# Altium schematic sheet Sheet1.SchDoc (part 2 of 2)
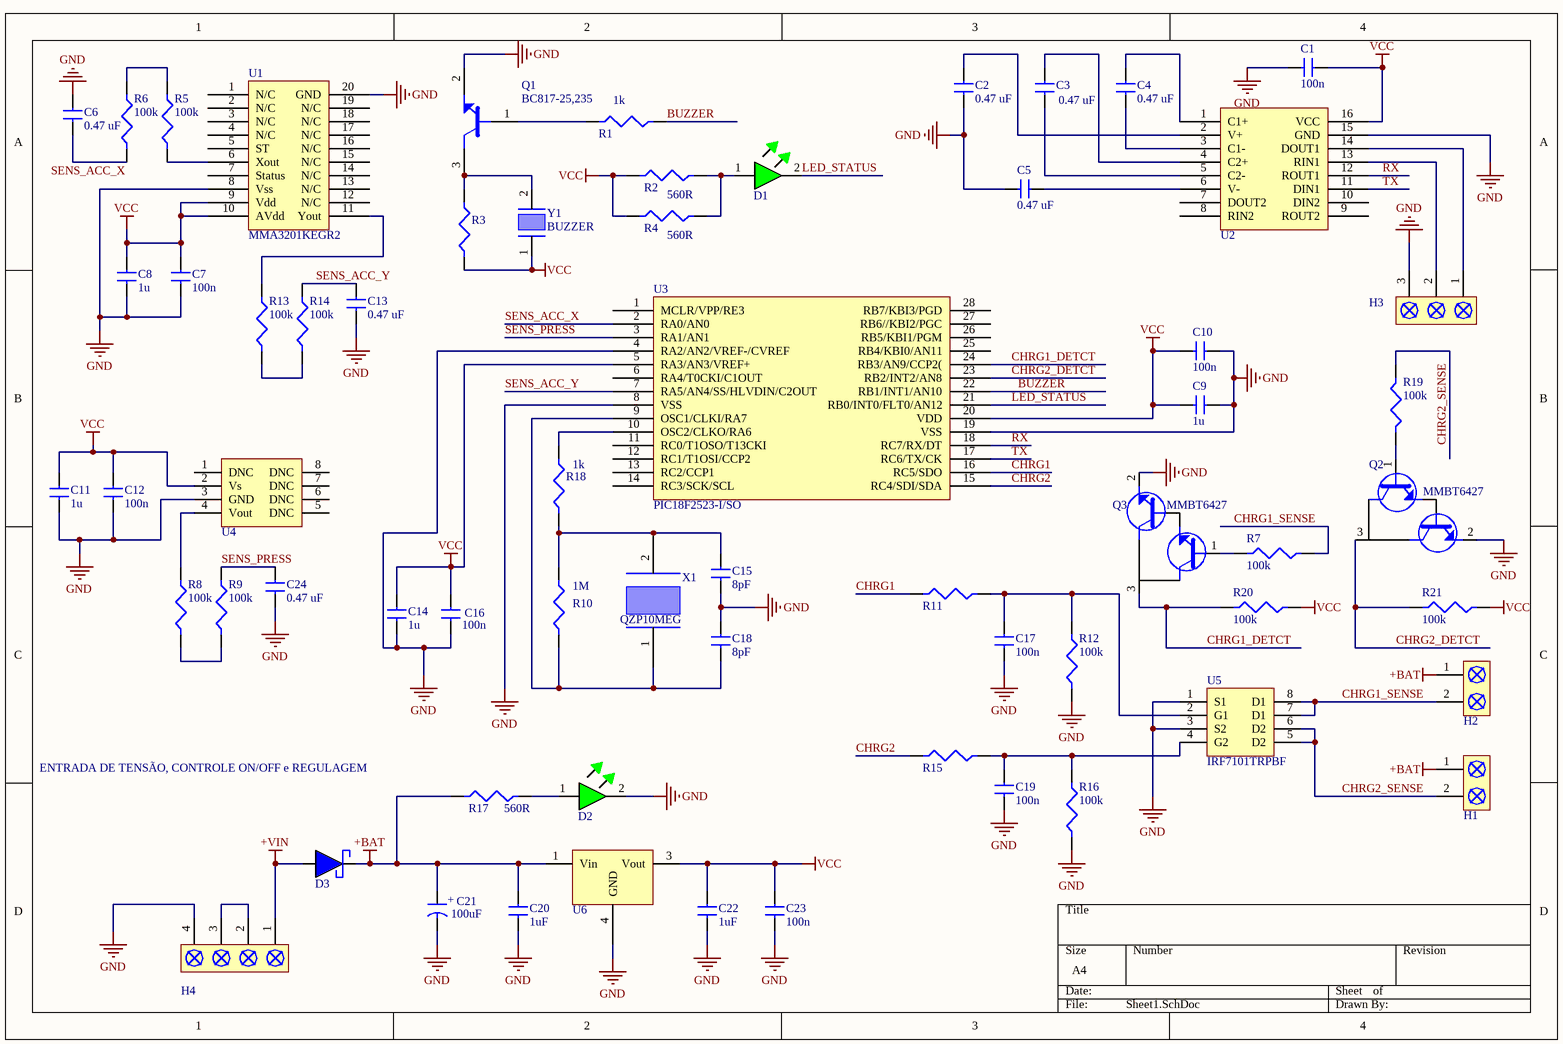
[diagram p1: Sheet1.SchDoc]

## Library data of the parts
C1 C7 C10 C12 C16 C17 C19 C23 = GRM155R71C104KA88D: Multilayer Ceramic Capacitor, 0.1 uF, 16 V, ï¿½ 10%, X7R, 0402 [1005 Metric]; Manufacturer: Murata; Dielectric Material: 4241ConductorMaterial; Capacitance: 100nF; Voltage Rating: 16V; Supplier 1: Future Electronics; Manufacturer Part Number: GRM155R71C104KA88D; RoHS: Yes; Category: Ceramic Capacitors; Stock 1: 33520000; Pricing 1: 10000=0,0044, 40000=0,0043, 100000=0,0042, 250000=0,004, 400000=0,0039 (USD); Mount: Surface Mount; Case/Package: 0402; Number of Pins: 2; Case Code (Metric): 1005; Case Code (Imperial): 0402; Material: Ceramic; Min Operating Temperature: -55°C; Max Operating Temperature: 125°C; Tolerance: 10%; Packaging: Tape and Reel; Voltage Rating (DC): 16V; Package Quantity: 1; Dielectric: X7R; Termination: SMD/SMT; Voltage: 16V; Series: GRM; Length: 1mm; Width: 0.02inch; Height: 0.5mm; Thickness: 0.022inch; Depth: 0.5mm; Radiation Hardening: No; Lead Free: Lead Free; RoHS Compliant: Yes; Reach SVHC Compliant: Unknown; ComponentLink1URL: https://datasheet.ciiva.com/129/grm155r71c104ka88-01-129739.pdf?src-supplier=Digikey; ComponentLink1Description: https://datasheet.ciiva.com/129/grm155r71c104ka88-01-129739.pdf?src-supplier=Digikey; ComponentLink2URL: https://datasheet.ciiva.com/129/grm155r71c104ka88-01-129740.pdf?src-supplier=Digikey; ComponentLink2Description: https://datasheet.ciiva.com/129/grm155r71c104ka88-01-129740.pdf?src-supplier=Digikey; ComponentLink3URL: https://datasheet.ciiva.com/18102/getdatasheetpartid-85307-18102905.pdf?src-supplier=Verical; ComponentLink3Description: https://datasheet.ciiva.com/18102/getdatasheetpartid-85307-18102905.pdf?src-supplier=Verical; ComponentLink4URL: https://datasheet.ciiva.com/29199/454098-da-01-en-vs-kondensator-0402-29199799.pdf?src-supplier=Conrad; ComponentLink4Description: https://datasheet.ciiva.com/29199/454098-da-01-en-vs-kondensator-0402-29199799.pdf?src-supplier=Conrad; ComponentLink5URL: https://datasheet.ciiva.com/7937/4360-7937615.pdf?src-supplier=Element14; ComponentLink5Description: https://datasheet.ciiva.com/7937/4360-7937615.pdf?src-supplier=Element14; ComponentLink6URL: https://datasheet.ciiva.com/28534/4360-28534127.pdf?src-supplier=Element14; ComponentLink6Description: https://datasheet.ciiva.com/28534/4360-28534127.pdf?src-supplier=Element14; ComponentLink7URL: https://datasheet.ciiva.com/28534/4360-28534133.pdf?src-supplier=Element14; ComponentLink7Description: https://datasheet.ciiva.com/28534/4360-28534133.pdf?src-supplier=Element14; ComponentLink8URL: https://datasheet.ciiva.com/16199/product-16199000.pdf?src-supplier=Future+Electronics; ComponentLink8Description: https://datasheet.ciiva.com/16199/product-16199000.pdf?src-supplier=Future+Electronics; ComponentLink9URL: https://datasheet.ciiva.com/14103/grmseries-highdielectrictype-eng-14103750.pdf?src-supplier=Distrelec; ComponentLink9Description: https://datasheet.ciiva.com/14103/grmseries-highdielectrictype-eng-14103750.pdf?src-supplier=Distrelec; ComponentLink10URL: https://datasheet.ciiva.com/14116/grmseries-highdielectrictype-eng-14116878.pdf?src-supplier=Distrelec; ComponentLink10Description: https://datasheet.ciiva.com/14116/grmseries-highdielectrictype-eng-14116878.pdf?src-supplier=Distrelec; Supplier Part Number 1: 5964861
C2-C6 C13 C24 = TMK107F474ZA-T: Multilayer Ceramic Capacitors (High dielectric type), 25V, 0.47 uF, +80%, 0603, Y5V/F, RoHS; Manufacturer: Taiyo; Value: 470nF; Dielectric: Y5V; Supplier: Newark; Supplier Part Number: 08P5185; Manufacturer Part Number: TMK107F474ZA-T; RoHS: No; Case/Package: 0603; Pins: 2; Packaging: Cut Tape; Voltage Rating (DC): 25V; Length: 1.6mm; Width: 800um; Height: 800um; Halogen Free: Halogen Free; Lead Free: Lead Free
C8 C9 C11 C14 = CC1206KKX7R7BB105: Multilayer Ceramic Capacitor, 1 uF, 16 V, ï¿½ 10%, X7R, 1206 [3216 Metric]; Manufacturer: Yageo; Material: 4241ConductorMaterial; Capacitance: 1uF; Voltage Rating: 16V; Insulation Resistance: 100GR; Supplier 1: Future Electronics; Manufacturer Part Number: CC1206KKX7R7BB105; RoHS: Yes; Category: Ceramic Capacitors; Stock 1: 174000; Pricing 1: 3000=0,0252 (USD); Mount: Surface Mount; Case/Package: 1206; Number of Pins: 2; Case Code (Metric): 3216; Case Code (Imperial): 1206; Dielectric Material: Ceramic; Min Operating Temperature: -55°C; Max Operating Temperature: 125°C; Packaging: Tape and Reel; Tolerance: 10%; Voltage Rating (DC): 16V; Package Quantity: 1; Dielectric: X7R; Termination: SMD/SMT; Series: CC; Voltage Rating (AC): 16V; Length: 3.2mm; Width: 0.063inch; Height: 1.15mm; Thickness: 0.045inch; Depth: 1.6mm; Radiation Hardening: No; Reach SVHC Compliant: No; Lead Free: Lead Free; Halogen Free: Halogen Free; RoHS Compliant: Yes; ComponentLink1URL: https://datasheet.ciiva.com/178/mlccorderingcode-178166.pdf?src-supplier=Digikey; ComponentLink1Description: https://datasheet.ciiva.com/178/mlccorderingcode-178166.pdf?src-supplier=Digikey; ComponentLink2URL: https://datasheet.ciiva.com/178/mlccorderingcode-178167.pdf?src-supplier=Digikey; ComponentLink2Description: https://datasheet.ciiva.com/178/mlccorderingcode-178167.pdf?src-supplier=Digikey; ComponentLink3URL: https://datasheet.ciiva.com/178/mlccorderingcode-178168.pdf?src-supplier=Digikey; ComponentLink3Description: https://datasheet.ciiva.com/178/mlccorderingcode-178168.pdf?src-supplier=Digikey; ComponentLink4URL: https://datasheet.ciiva.com/7978/1489800-7978229.pdf?src-supplier=Element14; ComponentLink4Description: https://datasheet.ciiva.com/7978/1489800-7978229.pdf?src-supplier=Element14; ComponentLink5URL: https://datasheet.ciiva.com/11464/upy-gphc-x7r-6-3v-to-50v-8-11464763.pdf?src-supplier=Avnet; ComponentLink5Description: https://datasheet.ciiva.com/11464/upy-gphc-x7r-6-3v-to-50v-8-11464763.pdf?src-supplier=Avnet; Supplier Part Number 1: 9057753
C15 C18 = GRM1555C1H8R0DZ01D: Cap Ceramic 8pF 50V C0G 0.5pF SMD 0402 125°C Paper T/R; Manufacturer: Murata; Supplier: CXDA Electronics; Supplier Part Number: GRM1555C1H8R0DZ01D; Manufacturer Part Number: GRM1555C1H8R0DZ01D; RoHS: Yes; Category: Ceramic Capacitors; Stock: 59869; Pricing: 10=0,05, 100=0,04, 1000=0,04, 10000=0,04 (USD); Mounting Technology: Surface Mount; Case/Package: 0402; Case Code (Metric): 1005; Case Code (Imperial): 0402; Min Operating Temperature: -55°C; Max Operating Temperature: 125°C; Value: 8pF; Voltage Rating: 50V; Packaging: Tape and Reel; Package Quantity: 10000; Dielectric: C0G; Termination: SMD/SMT; Voltage Rating (DC): 50V; Series: GRM; Construction: Flat; Length: 1mm; Width: 0.02inch; Height: 0.5mm; Thickness: 0.022inch; Depth: 0.5mm; Radiation Hardening: No; Lead Free: Lead Free; RoHS Compliant: Yes; ComponentLink1URL: https://datasheet.ciiva.com/3778/8361grm1555c1h8r0dz0123-3778464.pdf?src-supplier=Arrow+Electronics; ComponentLink1Description: https://datasheet.ciiva.com/3778/8361grm1555c1h8r0dz0123-3778464.pdf?src-supplier=Arrow+Electronics; ComponentLink2URL: https://datasheet.ciiva.com/5413/product-5413574.pdf?src-supplier=Mouser; ComponentLink2Description: https://datasheet.ciiva.com/5413/product-5413574.pdf?src-supplier=Mouser; ComponentLink3URL: https://datasheet.ciiva.com/11610/product-11610154.pdf?src-supplier=Avnet; ComponentLink3Description: https://datasheet.ciiva.com/11610/product-11610154.pdf?src-supplier=Avnet
C20 C22 = TPSA105K020R3000: Cap Tant Solid 1uF 20V A CASE 10%( 3.2 X 1.6 X 1.6mm) Inward L SMD 3216-18 3 Ohm 125C T/R; Manufacturer: Kyocera AVX; Dielectric Material: Tantalum; ESR (Equivalent Series Resistance): 3R; Polarity: Polar; Leakage Current: 500nA; Dissipation Factor: 4%; Supplier: Digikey; Supplier Part Number: 478-2399-1-ND; Manufacturer Part Number: TPSA105K020R3000; RoHS: Yes; Category: Tantalum Capacitors; Stock: 46298; Pricing: 1=0,76, 10=0,459, 50=0,3398, 100=0,3028, 500=0,2398, 1000=0,22014, 2000=0,20387, 4000=0,19039, 6000=0,18361, 10000=0,17607, 14000=0,17164, 20000=0,16737, 50000=0,15812 (USD); Mounting Technology: Surface Mount,PCB; Case/Package: 1206; Pins: 2; Case Code (Metric): 3216; Case Code (Imperial): 1206; Weight: 0.000571oz; Min Operating Temperature: -55°C; Max Operating Temperature: 125°C; Value: 1uF; Tolerance: 10%; Voltage Rating: 20V; Packaging: Tape and Reel; Package Quantity: 1; Termination: SMD/SMT; Voltage Rating (DC): 20V; Voltage: 20V; Features: General Purpose; Series: TPS; Construction: Flat; Length: 3.2mm; Width: 1.6mm; Height: 1.6mm; Height - Seated (Max): 0.071inch; Depth: 1.6mm; Lead Pitch: 1.1mm; Radiation Hardening: No; Reach SVHC Compliant: No; Lead Free: Lead Free; RoHS Compliant: Yes; ComponentLink1URL: https://datasheet.ciiva.com/26341/806571-da-01-en-smd-tantal1uf-20v-10-3-000r-2000st-26341825.pdf?src-supplier=Conrad; ComponentLink1Description: https://datasheet.ciiva.com/26341/806571-da-01-en-smd-tantal1uf-20v-10-3-000r-2000st-26341825.pdf?src-supplier=Conrad; ComponentLink2URL: https://datasheet.ciiva.com/263/tps-263911.pdf?src-supplier=Digikey; ComponentLink2Description: https://datasheet.ciiva.com/263/tps-263911.pdf?src-supplier=Digikey; ComponentLink3URL: https://datasheet.ciiva.com/263/tps-263912.pdf?src-supplier=Digikey; ComponentLink3Description: https://datasheet.ciiva.com/263/tps-263912.pdf?src-supplier=Digikey; ComponentLink4URL: https://datasheet.ciiva.com/263/tps-263913.pdf?src-supplier=Digikey; ComponentLink4Description: https://datasheet.ciiva.com/263/tps-263913.pdf?src-supplier=Digikey; ComponentLink5URL: https://datasheet.ciiva.com/7832/1441576-7832617.pdf?src-supplier=Element14; ComponentLink5Description: https://datasheet.ciiva.com/7832/1441576-7832617.pdf?src-supplier=Element14; ComponentLink6URL: https://datasheet.ciiva.com/7832/1441576-7832845.pdf?src-supplier=Element14; ComponentLink6Description: https://datasheet.ciiva.com/7832/1441576-7832845.pdf?src-supplier=Element14; ComponentLink7URL: https://datasheet.ciiva.com/7832/1441576-7832846.pdf?src-supplier=Element14; ComponentLink7Description: https://datasheet.ciiva.com/7832/1441576-7832846.pdf?src-supplier=Element14; ComponentLink8URL: https://datasheet.ciiva.com/7832/tps-7832847.pdf?src-supplier=Element14; ComponentLink8Description: https://datasheet.ciiva.com/7832/tps-7832847.pdf?src-supplier=Element14; ComponentLink9URL: https://datasheet.ciiva.com/28555/1932865-28555241.pdf?src-supplier=Element14; ComponentLink9Description: https://datasheet.ciiva.com/28555/1932865-28555241.pdf?src-supplier=Element14; ComponentLink10URL: https://datasheet.ciiva.com/12910/tps-23028-12910247.pdf?src-supplier=Mouser; ComponentLink10Description: https://datasheet.ciiva.com/12910/tps-23028-12910247.pdf?src-supplier=Mouser; ComponentLink11URL: https://datasheet.ciiva.com/16224/tps-16224686.pdf?src-supplier=Future+Electronics; ComponentLink11Description: https://datasheet.ciiva.com/16224/tps-16224686.pdf?src-supplier=Future+Electronics; ComponentLink12URL: https://datasheet.ciiva.com/14590/70001047-14590583.pdf?src-supplier=Allied+Electronics; ComponentLink12Description: https://datasheet.ciiva.com/14590/70001047-14590583.pdf?src-supplier=Allied+Electronics; ComponentLink13URL: https://datasheet.ciiva.com/14590/70001047-14590587.pdf?src-supplier=Allied+Electronics; ComponentLink13Description: https://datasheet.ciiva.com/14590/70001047-14590587.pdf?src-supplier=Allied+Electronics; ComponentLink14URL: https://datasheet.ciiva.com/3004/tps-3004579.pdf?src-supplier=Avnet; ComponentLink14Description: https://datasheet.ciiva.com/3004/tps-3004579.pdf?src-supplier=Avnet
C21 = B45197A3107K509: Cap 100UF 16VDC 10% 7.3 X 4.3 X 4.1MM SMD 7343-43 T/r; Manufacturer: KEMET; Dielectric Material: Tantalum; Voltage Rating: 16V; ESR (Equivalent Series Resistance): 100mR; Leakage Current: 16uA; Dissipation Factor: 8%; Supplier 1: Farnell; Manufacturer Part Number: B45197A3107K509; RoHS: Yes; Category: Tantalum Capacitors; Pricing 1: 1=2,31, 10=1,54, 50=1,07, 100=0,889, 200=0,771, 400=0,66, 2000=0,578 (GBP); Mount: Surface Mount; Case/Package: 2917; Number of Pins: 2; Case Code (Imperial): 2917; Case Code (Metric): 7343; Weight: 0.023634oz; Min Operating Temperature: -55°C; Max Operating Temperature: 125°C; Capacitance: 100uF; Tolerance: 10%; Voltage Rating (DC): 16V; Packaging: Tape and Reel; Termination: SMD/SMT; Series: B45197A; Voltage: 16V; Length: 7.3mm; Width: 4.3mm; Height: 4.4mm; Depth: 4.3mm; RoHS Compliant: Yes; Reach SVHC Compliant: No; Lead Free: Lead Free; ComponentLink1URL: https://datasheet.ciiva.com/5934/58264-5934481.pdf?src-supplier=Farnell; ComponentLink1Description: https://datasheet.ciiva.com/5934/58264-5934481.pdf?src-supplier=Farnell; ComponentLink2URL: https://datasheet.ciiva.com/11793/0900766b809b4274-11793801.pdf?src-supplier=Rs; ComponentLink2Description: https://datasheet.ciiva.com/11793/0900766b809b4274-11793801.pdf?src-supplier=Rs; ComponentLink3URL: https://datasheet.ciiva.com/1464/1761160-1464734.pdf?src-supplier=Element14; ComponentLink3Description: https://datasheet.ciiva.com/1464/1761160-1464734.pdf?src-supplier=Element14; ComponentLink4URL: https://datasheet.ciiva.com/1464/1761160-1464735.pdf?src-supplier=Element14; ComponentLink4Description: https://datasheet.ciiva.com/1464/1761160-1464735.pdf?src-supplier=Element14; Supplier Part Number 1: 9751084
D1 D2 = LNJ314G8TRA: Led SMT Grn Cut Tapes; Manufacturer: Panasonic SSG; Color: Green; Forward Current: 10mA; Forward Voltage: 2.03V; Luminous Intensity: 5mcd; Power Rating: 40mW; Lens Style: Flat,Rectangular; Wavelength: 565nm; Number of LEDs: 1; Lens Size: 0.8mm; Supplier 1: Ampacity Systems; Manufacturer Part Number: LNJ314G8TRA; RoHS: Yes; Category: LEDs; Stock 1: 450; Pricing 1: 1=1,03385 (USD); Mount: Surface Mount; Case/Package: 0603; Number of Pins: 2; Case Code (Metric): 1608; Case Code (Imperial): 0603; Min Operating Temperature: -30°C; Max Operating Temperature: 85°C; Packaging: Tape and Reel; Illumination Color: Green; Test Current: 10mA; Series: -; Length: 1.6mm; Width: 0.8mm; Height: 0.5mm; Radiation Hardening: No; Lead Free: Lead Free; RoHS Compliant: Yes; ComponentLink1URL: https://datasheet.ciiva.com/9326/lnj314g8tra-bek-discon-9326750.pdf?src-supplier=Avnet; ComponentLink1Description: https://datasheet.ciiva.com/9326/lnj314g8tra-bek-discon-9326750.pdf?src-supplier=Avnet; Supplier Part Number 1: LNJ314G8TRA
D3 = SD0805S020S1R0: Small Signal Schottky Diode, Single, 20 V, 1 A, 450 Mv, 10 A, 125 C Rohs Compliant: Yes; Manufacturer: Kyocera AVX; Max Surge Current: 10A; Forward Voltage: 450mV; Forward Current: 1A; Max Reverse Current: 200uA; Max Repetitive Reverse Voltage (Vrrm): 20V; Supplier: Digikey; Supplier Part Number: 478-7800-1-ND; Manufacturer Part Number: SD0805S020S1R0; RoHS: Yes; Category: Rectifier Diodes; Stock: 72775; Pricing: 1=0,51, 10=0,311, 100=0,1972, 500=0,14792, 1000=0,132, 3000=0,11174, 6000=0,10152, 9000=0,09631, 15000=0,09046, 21000=0,08699, 30000=0,08362, 75000=0,07622 (USD); Mounting Technology: Surface Mount; Case/Package: 0805; Pins: 2; Case Code (Metric): 2012; Case Code (Imperial): 0805; Min Operating Temperature: -55°C; Max Operating Temperature: 125°C; Packaging: Cut Tape; Average Rectified Current: 1A; Max Reverse Leakage Current: 200uA; Max Forward Surge Current (Ifsm): 10A; Peak Non-Repetitive Surge Current: 10A; Max Reverse Voltage (DC): 20V; Series: -; Radiation Hardening: No; Reach SVHC Compliant: No; RoHS Compliant: Yes; ComponentLink1URL: https://datasheet.ciiva.com/29883/schottky-29883740.pdf?src-supplier=Avnet; ComponentLink1Description: https://datasheet.ciiva.com/29883/schottky-29883740.pdf?src-supplier=Avnet; ComponentLink2URL: https://datasheet.ciiva.com/29883/schottky-29883741.pdf?src-supplier=Avnet; ComponentLink2Description: https://datasheet.ciiva.com/29883/schottky-29883741.pdf?src-supplier=Avnet; ComponentLink3URL: https://datasheet.ciiva.com/13084/schottky-221155-13084174.pdf?src-supplier=Mouser; ComponentLink3Description: https://datasheet.ciiva.com/13084/schottky-221155-13084174.pdf?src-supplier=Mouser
H1 H2 = 1725656: Block, Terminal; 6 A; 63 V; 2.54 mm; 26 to 20 AWG; 2; Screw; Soldering; 1.5 kV; Manufacturer: Phoenix Contact; Number of Poles: 2; Voltage Rating: 125V; Max Current Rating: 6A; Max Supply Voltage: 63V; Number of Levels: 1; Connector Type: Screw,PCB,Terminal Block; Wire Gauge (Max): 26AWG; Wire Gauge (Min): 20AWG; Pitch: 2.54mm; Stripping Length: 4.5mm; Approvals: UL,CSA,cULus,EAC; Supplier 1: Mouser; Manufacturer Part Number: 1725656; RoHS: Yes; Category: Terminal Blocks; Stock 1: 18801; Pricing 1: 1=1,66, 10=1,14, 50=1,14, 100=1,14, 1000=1,13, 10000=1,13 (USD); Mount: Through Hole; Number of Pins: 2; Color: Green; Weight: 0.022575oz; Housing Material: Polyamide; Contact Material: Tin; Housing Color: 49Colour; Insulation Material: 4261ConductorMaterial; Termination: Solder; Orientation: Straight; Package Quantity: 50; Packaging: Bulk; Number of Rows: 1; Current Rating: 6A; Number of Positions Per Level: 2; Current: 6A; Voltage: 125V; Number of Positions: 2; Number of Contacts: 2; Number of Circuits: 2; Series: MPT; Length: 5.54mm; Width: 12mm; Height: 6.2mm; Wire/Cable Gauge: 26AWG; Depth: 6.2mm; Radiation Hardening: No; RoHS Compliant: Yes; Reach SVHC Compliant: No; Lead Free: Lead Free; Flammability Rating: UL94 V-0; ComponentLink1URL: https://datasheet.ciiva.com/823/1725656-823793.pdf?src-supplier=Digikey; ComponentLink1Description: https://datasheet.ciiva.com/823/1725656-823793.pdf?src-supplier=Digikey; ComponentLink2URL: https://datasheet.ciiva.com/1120/319957-1120510.pdf?src-supplier=Farnell; ComponentLink2Description: https://datasheet.ciiva.com/1120/319957-1120510.pdf?src-supplier=Farnell; ComponentLink3URL: https://datasheet.ciiva.com/15169/getdatasheetpartid-199323-15169849.pdf?src-supplier=Verical; ComponentLink3Description: https://datasheet.ciiva.com/15169/getdatasheetpartid-199323-15169849.pdf?src-supplier=Verical; ComponentLink4URL: https://datasheet.ciiva.com/16071/1725656-16071846.pdf?src-supplier=Onlinecomponents.com; ComponentLink4Description: https://datasheet.ciiva.com/16071/1725656-16071846.pdf?src-supplier=Onlinecomponents.com; ComponentLink5URL: https://datasheet.ciiva.com/26340/788052-da-01-en-100ntklemme-1725656-250-st-26340907.pdf?src-supplier=Conrad; ComponentLink5Description: https://datasheet.ciiva.com/26340/788052-da-01-en-100ntklemme-1725656-250-st-26340907.pdf?src-supplier=Conrad; Supplier Part Number 1: 651-1725656
H3 = 1725669: Terminal Block Connector; 6 A; 63 V; 2.54 mm; 26 to 20 AWG; 3; Screw; Soldering; 1.5 kV; Manufacturer: Phoenix Contact; Current Rating: 6A; Number of Poles: 3; Voltage Rating: 125V; Max Supply Voltage: 63V; Number of Levels: 1; Connector Type: Screw,PCB,Terminal Block; Wire/Cable Gauge: 26AWG; Wire Gauge (Min): 20AWG; Pitch: 2.54mm; Stripping Length: 4.5mm; Approvals: UL,CSA,cULus,EAC; Supplier 1: Onlinecomponents.com; Manufacturer Part Number: 1725669; RoHS: Yes; Category: Terminal Blocks; Stock 1: 743; Pricing 1: 10=2,04, 100=1,77, 250=1,72, 500=1,68, 1000=1,64, 2500=1,61, 5000=1,59, 7500=1,57 (USD); Mount: Through Hole; Number of Pins: 3; Weight: 0.021658oz; Color: Green; Housing Color: Green; Housing Material: Polyamide; Insulation Material: Nylon; Contact Material: Tin; Package Quantity: 250; Number of Rows: 1; Max Current Rating: 6A; Packaging: Bulk; Number of Positions: 3; Termination: Solder; Number of Positions Per Level: 3; Current: 6A; Voltage: 125V; Number of Contacts: 3; Number of Circuits: 3; Orientation: Straight; Series: MPT; Length: 6.2mm; Width: 13mm; Height: 8.08mm; Wire Gauge (Max): 26AWG; Depth: 6.2mm; Radiation Hardening: No; Reach SVHC Compliant: No; Lead Free: Lead Free; Flammability Rating: UL94 V-0; RoHS Compliant: Yes; ComponentLink1URL: https://datasheet.ciiva.com/823/1725669-823803.pdf?src-supplier=Digikey; ComponentLink1Description: https://datasheet.ciiva.com/823/1725669-823803.pdf?src-supplier=Digikey; ComponentLink2URL: https://datasheet.ciiva.com/1118/1761576-1118544.pdf?src-supplier=Element14; ComponentLink2Description: https://datasheet.ciiva.com/1118/1761576-1118544.pdf?src-supplier=Element14; ComponentLink3URL: https://datasheet.ciiva.com/7053/312657-7053092.pdf?src-supplier=Newark; ComponentLink3Description: https://datasheet.ciiva.com/7053/312657-7053092.pdf?src-supplier=Newark; ComponentLink4URL: https://datasheet.ciiva.com/3969/1725669-3969975.pdf?src-supplier=Arrow+Electronics; ComponentLink4Description: https://datasheet.ciiva.com/3969/1725669-3969975.pdf?src-supplier=Arrow+Electronics; ComponentLink5URL: https://datasheet.ciiva.com/15169/getdatasheetpartid-178016-15169707.pdf?src-supplier=Verical; ComponentLink5Description: https://datasheet.ciiva.com/15169/getdatasheetpartid-178016-15169707.pdf?src-supplier=Verical; ComponentLink6URL: https://datasheet.ciiva.com/16071/1725669-16071848.pdf?src-supplier=Onlinecomponents.com; ComponentLink6Description: https://datasheet.ciiva.com/16071/1725669-16071848.pdf?src-supplier=Onlinecomponents.com; ComponentLink7URL: https://datasheet.ciiva.com/14607/70054336-14607349.pdf?src-supplier=Allied+Electronics; ComponentLink7Description: https://datasheet.ciiva.com/14607/70054336-14607349.pdf?src-supplier=Allied+Electronics; ComponentLink8URL: https://datasheet.ciiva.com/29223/717267-da-01-en-printklemme-1725669-250-st-29223852.pdf?src-supplier=Conrad; ComponentLink8Description: https://datasheet.ciiva.com/29223/717267-da-01-en-printklemme-1725669-250-st-29223852.pdf?src-supplier=Conrad; Supplier Part Number 1: 1725669
H4 = MPT0,5/4-2,54: Wire-To-Board Terminal Block Rating to EN: 6 A @ 63 VAC/VDC Rating to UL: 6 A @ 125 VAC/VDC Temperature range: -20...; Manufacturer: Phoenix Contact; Max Current Rating: 6A; Max Supply Voltage: 63V; Wire Gauge (Max): 26AWG; Wire Gauge (Min): 20AWG; Supplier 1: Sourcengine; Manufacturer Part Number: MPT0,5/4-2,54; RoHS: Yes; Category: Terminal Blocks; Stock 1: 49; Number of Pins: 4; Housing Material: 4261ConductorMaterial; Termination: Screw; Number of Rows: 1NUMBER; Orientation: 5491OrientationType; Length: 10.62mm; Depth: 6.2mm; RoHS Compliant: Yes; ComponentLink1URL: https://www.distrelec.biz/Web/Downloads/20/76/uu142076.pdf?mime=application%2Fpdf&src-supplier=Distrelec; ComponentLink1Description: https://www.distrelec.biz/Web/Downloads/20/76/uu142076.pdf?mime=application%2Fpdf&src-supplier=Distrelec; Supplier Part Number 1: MPT0,5/4-2,54
Q1 = BC817-25,235: BC817 Series 45V 500mA SMT NPN General Purpose Transistor - SOT-23; Manufacturer: Nexperia; Collector Base Voltage (VCBO): 50V; Collector Emitter Saturation Voltage: 700mV; Emitter Base Voltage (VEBO): 5V; hFE Min: 160; Number of Elements: 1; Power Dissipation: 250mW; Supplier 1: Future Electronics; Manufacturer Part Number: BC817-25,235; RoHS: Yes; Category: BJTs; Stock 1: 6440000; Pricing 1: 10000=0,0123, 30000=0,0119, 50000=0,0117, 100000=0,0114, 200000=0,011 (USD); Number of Pins: 3; Max Operating Temperature: 150°C; Packaging: Tape and Reel; Polarity: NPN; Collector Emitter Breakdown Voltage: 45V; Collector Emitter Voltage (VCEO): 45V; Max Collector Current: 500mA; Height: 1.1mm; RoHS Compliant: Yes; ComponentLink1URL: https://datasheet.octopart.com/BC817-25%2C235-Nexperia-datasheet-108335331.pdf?src-supplier=Farnell; ComponentLink1Description: https://datasheet.octopart.com/BC817-25%2C235-Nexperia-datasheet-108335331.pdf?src-supplier=Farnell; ComponentLink2URL: https://assets.nexperia.com/documents/data-sheet/BC817_SER.pdf?src-supplier=Digikey; ComponentLink2Description: https://assets.nexperia.com/documents/data-sheet/BC817_SER.pdf?src-supplier=Digikey; Supplier Part Number 1: 3451903
Q2 Q3 = MMBT6427-7-F: MMBT6427 Series 40 V 500 mA NPN Surface Mount Darlington Transistor - SOT-23-3; Manufacturer: Diodes; Collector Emitter Voltage (VCEO): 40V; hFE Min: 10000; Max Collector Current: 500mA; Max Power Dissipation: 300mW; Emitter Base Voltage (VEBO): 12V; Collector Emitter Saturation Voltage: 1.2V; Number of Elements: 1; Collector-emitter Voltage-Max: 1.5V; Supplier 1: Digikey; Manufacturer Part Number: MMBT6427-7-F; RoHS: Yes; Category: BJTs; Stock 1: 25429; Pricing 1: 1=0,21, 10=0,128, 100=0,0796, 500=0,05812, 1000=0,05115 (USD); Mount: Surface Mount; Case/Package: SOT-23; Number of Pins: 3; Weight: 0.000282oz; Min Operating Temperature: -55°C; Max Operating Temperature: 150°C; Packaging: Tape and Reel; Package Quantity: 3000; Polarity: NPN; Collector Base Voltage (VCBO): 40V; Collector Emitter Breakdown Voltage: 40V; Max Breakdown Voltage: 40V; Current Rating: 500mA; Voltage Rating (DC): 40V; Series: Automotive, AEC-Q101; Length: 3.05mm; Width: 1.4mm; Height: 1mm; Radiation Hardening: No; Lead Free: Lead Free; RoHS Compliant: Yes; ComponentLink1URL: https://datasheet.ciiva.com/11211/ds30048-11211443.pdf?src-supplier=Avnet; ComponentLink1Description: https://datasheet.ciiva.com/11211/ds30048-11211443.pdf?src-supplier=Avnet; ComponentLink2URL: https://datasheet.ciiva.com/4459/ds30048-82966-4459317.pdf?src-supplier=Mouser; ComponentLink2Description: https://datasheet.ciiva.com/4459/ds30048-82966-4459317.pdf?src-supplier=Mouser; ComponentLink3URL: https://datasheet.ciiva.com/15139/getdatasheetpartid-67553-15139920.pdf?src-supplier=Verical; ComponentLink3Description: https://datasheet.ciiva.com/15139/getdatasheetpartid-67553-15139920.pdf?src-supplier=Verical; ComponentLink4URL: https://datasheet.ciiva.com/973/ds30048-973062.pdf?src-supplier=Digikey; ComponentLink4Description: https://datasheet.ciiva.com/973/ds30048-973062.pdf?src-supplier=Digikey; ComponentLink5URL: https://datasheet.ciiva.com/973/ds30048-973063.pdf?src-supplier=Digikey; ComponentLink5Description: https://datasheet.ciiva.com/973/ds30048-973063.pdf?src-supplier=Digikey; Supplier Part Number 1: MMBT6427-FDICT-ND
R1 R3 R11 R15 R18 = CRCW04021K00JNED: Res Thick Film 0402 1K Ohm 5% 1/16W ±200ppm/°C Molded SMD SMD Paper T/R; Manufacturer: Vishay Dale; Resistance: 1kR; Max Power Dissipation: 63mW; Voltage Rating: 50V; Supplier 1: Mouser; Manufacturer Part Number: CRCW04021K00JNED; RoHS: Yes; Category: Chip SMD Resistors; Stock 1: 255010; Pricing 1: 1=0,1, 10=0,016, 50=0,016, 100=0,009, 1000=0,008, 2500=0,006, 10000=0,004, 20000=0,003 (USD); Case/Package: 0402; Number of Pins: 2; Case Code (Imperial): 0402; Case Code (Metric): 1005; Weight: 2.3E-05oz; Contact Plating: Tin; Min Operating Temperature: -55°C; Max Operating Temperature: 155°C; Packaging: Tape and Reel; Tolerance: 5%; Number of Terminations: 2; Temperature Coefficient: 200ppm/°C; Series: CRCW; Power Rating: 63mW; Package Quantity: 1; Termination: SMD/SMT; Features: Automotive AEC-Q200; Technology: THICK FILM; Resistor Type: Thick Film; Working Voltage: 50V; Resistance Tolerance: 5%; Construction: Rectangular; Voltage Rating (DC): 50V; Length: 1mm; Width: 0.02inch; Height: 0.016inch; Depth: 0.5mm; Ratings: AEC-Q200; Radiation Hardening: No; RoHS Compliant: Yes; Lead Free: Lead Free; Military Standard: Not; Reach SVHC Compliant: Unknown; ComponentLink1URL: https://datasheet.ciiva.com/2462/dcrcwe3-2462076.pdf?src-supplier=Digikey; ComponentLink1Description: https://datasheet.ciiva.com/2462/dcrcwe3-2462076.pdf?src-supplier=Digikey; ComponentLink2URL: https://datasheet.ciiva.com/2462/dcrcwe3-2462077.pdf?src-supplier=Digikey; ComponentLink2Description: https://datasheet.ciiva.com/2462/dcrcwe3-2462077.pdf?src-supplier=Digikey; ComponentLink3URL: https://datasheet.ciiva.com/2462/dcrcwe3-2462078.pdf?src-supplier=Digikey; ComponentLink3Description: https://datasheet.ciiva.com/2462/dcrcwe3-2462078.pdf?src-supplier=Digikey; ComponentLink4URL: https://datasheet.ciiva.com/7743/dcrcwe3-7743478.pdf?src-supplier=Element14; ComponentLink4Description: https://datasheet.ciiva.com/7743/dcrcwe3-7743478.pdf?src-supplier=Element14; ComponentLink5URL: https://datasheet.ciiva.com/5545/dcrcwe3-109170-5545913.pdf?src-supplier=Mouser; ComponentLink5Description: https://datasheet.ciiva.com/5545/dcrcwe3-109170-5545913.pdf?src-supplier=Mouser; ComponentLink6URL: https://datasheet.ciiva.com/28621/1847332-28621342.pdf?src-supplier=Element14; ComponentLink6Description: https://datasheet.ciiva.com/28621/1847332-28621342.pdf?src-supplier=Element14; ComponentLink7URL: https://datasheet.ciiva.com/16199/dcrcwe3-16199256.pdf?src-supplier=Future+Electronics; ComponentLink7Description: https://datasheet.ciiva.com/16199/dcrcwe3-16199256.pdf?src-supplier=Future+Electronics; ComponentLink8URL: https://datasheet.ciiva.com/16778/70201119-16778053.pdf?src-supplier=Allied+Electronics; ComponentLink8Description: https://datasheet.ciiva.com/16778/70201119-16778053.pdf?src-supplier=Allied+Electronics; Supplier Part Number 1: 71-CRCW0402J-1.0K-E3
R2 R4 R17 = CRCW0402560RJNED: SMD Chip Resistor, 560 Ohm, ± 5%, 63 mW, 0402 [1005 Metric], Thick Film, General Purpose; Manufacturer: Vishay Dale; Power Rating: 63mW; Temperature Coefficient: 200ppm/°C; Voltage Rating: 50V; Supplier 1: Mouser; Manufacturer Part Number: CRCW0402560RJNED; RoHS: Yes; Category: Chip SMD Resistors; Stock 1: 36463; Pricing 1: 1=0,1, 10=0,015, 50=0,015, 100=0,009, 1000=0,007, 2500=0,006, 10000=0,004 (USD); Case/Package: 0402; Number of Pins: 2; Case Code (Metric): 1005; Case Code (Imperial): 0402; Contact Plating: Tin; Weight: 2.3E-05oz; Size Code: 0402; Min Operating Temperature: -55°C; Max Operating Temperature: 155°C; Resistance: 560R; Packaging: Cut Tape; Tolerance: 5%; Package Quantity: 10000; Resistor Type: Thick Film; Number of Terminations: 2; Max Power Dissipation: 63mW; Features: Automotive AEC-Q200; Series: CRCW; Voltage Rating (DC): 50V; Resistance Tolerance: 5%; Length: 1mm; Width: 0.5mm; Height: 0.35mm; Ratings: AEC-Q200; Radiation Hardening: No; Lead Free: Lead Free; RoHS Compliant: Yes; Reach SVHC Compliant: Unknown; ComponentLink1URL: https://datasheet.ciiva.com/2524/dcrcwe3-2524414.pdf?src-supplier=Digikey; ComponentLink1Description: https://datasheet.ciiva.com/2524/dcrcwe3-2524414.pdf?src-supplier=Digikey; ComponentLink2URL: https://datasheet.ciiva.com/2524/dcrcwe3-2524415.pdf?src-supplier=Digikey; ComponentLink2Description: https://datasheet.ciiva.com/2524/dcrcwe3-2524415.pdf?src-supplier=Digikey; ComponentLink3URL: https://datasheet.ciiva.com/2524/dcrcwe3-2524416.pdf?src-supplier=Digikey; ComponentLink3Description: https://datasheet.ciiva.com/2524/dcrcwe3-2524416.pdf?src-supplier=Digikey; ComponentLink4URL: https://datasheet.ciiva.com/3256/dcrcwe3-3256649.pdf?src-supplier=Avnet; ComponentLink4Description: https://datasheet.ciiva.com/3256/dcrcwe3-3256649.pdf?src-supplier=Avnet; ComponentLink5URL: https://datasheet.ciiva.com/3256/dcrcwe3-3256650.pdf?src-supplier=Avnet; ComponentLink5Description: https://datasheet.ciiva.com/3256/dcrcwe3-3256650.pdf?src-supplier=Avnet; ComponentLink6URL: https://datasheet.ciiva.com/16436/dcrcwe3-16436119.pdf?src-supplier=Future+Electronics; ComponentLink6Description: https://datasheet.ciiva.com/16436/dcrcwe3-16436119.pdf?src-supplier=Future+Electronics; ComponentLink7URL: https://datasheet.ciiva.com/5548/dcrcwe3-109170-5548972.pdf?src-supplier=Mouser; ComponentLink7Description: https://datasheet.ciiva.com/5548/dcrcwe3-109170-5548972.pdf?src-supplier=Mouser; Supplier Part Number 1: 71-CRCW0402J-560-E3
R5 R6 R8 R9 R12-R14 R16 R20 R21 = ERJ-PA3F1003V: SMD Chip Resistor, 100 kOhm, ± 1%, 250 mW, 0603 [1608 Metric], Thick Film, Anti-Surge; Manufacturer: Panasonic; Resistance: 100kR; Power Rating: 250mW; Voltage Rating: 150V; Temperature Coefficient: 100ppm/°C; Supplier 1: Digikey; Manufacturer Part Number: ERJ-PA3F1003V; RoHS: Yes; Category: Chip SMD Resistors; Stock 1: 59135; Pricing 1: 1=0,14, 10=0,071, 50=0,0468, 100=0,0397, 500=0,0282, 1000=0,02477 (USD); Mount: Surface Mount; Case/Package: 0603; Case Code (Metric): 1608; Case Code (Imperial): 0603; Min Operating Temperature: -55°C; Max Operating Temperature: 155°C; Tolerance: 1%; Resistor Type: Thick Film; Packaging: Cut Tape; Number of Terminations: 2; Termination: Solder; Max Power Dissipation: 250mW; Voltage Rating (DC): 150V; Features: Automotive AEC-Q200; Series: ERJ; Resistance Tolerance: 1%; Technology: THICK FILM; Length: 0.063inch; Width: 0.031inch; Height: 0.018inch; Depth: 0.8mm; Ratings: AEC-Q200; Reach SVHC Compliant: No; ComponentLink1URL: https://datasheet.ciiva.com/22781/1801181-22781557.pdf?src-supplier=Farnell; ComponentLink1Description: https://datasheet.ciiva.com/22781/1801181-22781557.pdf?src-supplier=Farnell; ComponentLink2URL: https://datasheet.ciiva.com/49048/1801181-49048299.pdf?src-supplier=Element14; ComponentLink2Description: https://datasheet.ciiva.com/49048/1801181-49048299.pdf?src-supplier=Element14; Supplier Part Number 1: P100KBYCT-ND
R7 R19 = RCA0402100KFKED: RCA FIXED RESISTOR 0402 (1005Metric) Chip Resistor ±1% ±100ppm/C 100kOhm 0.063W 1/16W; Manufacturer: Vishay Dale; Resistance: 100kR; Max Power Dissipation: 63mW; Temperature Coefficient: 100ppm/°C; Voltage Rating (DC): 50V; Supplier 1: Mouser; Manufacturer Part Number: RCA0402100KFKED; RoHS: Yes; Category: Chip SMD Resistors; Stock 1: 20781; Pricing 1: 1=0,1, 10=0,027, 50=0,027, 100=0,016, 1000=0,013, 2500=0,011, 10000=0,01 (USD); Case/Package: 0402; Case Code (Metric): 1005; Case Code (Imperial): 0402; Contact Plating: Tin; Min Operating Temperature: -55°C; Max Operating Temperature: 155°C; Packaging: Tape and Reel; Series: RCA; Tolerance: 1%; Number of Terminations: 2; Features: Automotive AEC-Q200,Anti-Sulfur; Power Rating: 63mW; Resistor Type: Thick Film; Voltage Rating: 50V; Resistance Tolerance: 1%; Length: 0.039inch; Width: 0.02inch; Height: 0.016inch; Radiation Hardening: No; RoHS Compliant: Yes; Lead Free: Lead Free; Reach SVHC Compliant: No; ComponentLink1URL: https://datasheet.ciiva.com/8980/rcae3-8980646.pdf?src-supplier=Avnet; ComponentLink1Description: https://datasheet.ciiva.com/8980/rcae3-8980646.pdf?src-supplier=Avnet; Supplier Part Number 1: 71-RCA0402100KFKED
R10 = CRCW04021M00FKEDC: Res Thick Film 0402 1M Ohm 1% 0.063W(1/16W) ±100ppm/C Pad SMD T/R; Manufacturer: Vishay Semiconductors; Max Power Dissipation: 63mW; Resistance: 1MR; Temperature Coefficient: 100ppm/°C; Voltage Rating: 50V; Supplier 1: Mouser; Manufacturer Part Number: CRCW04021M00FKEDC; RoHS: Yes; Category: Chip SMD Resistors; Stock 1: 316158; Pricing 1: 1=0,1, 10=0,016, 50=0,016, 100=0,009, 1000=0,007, 2500=0,005, 10000=0,003 (USD); Case/Package: 0402; Min Operating Temperature: -55°C; Max Operating Temperature: 155°C; Series: CRCW-C; Packaging: Tape and Reel; Tolerance: 1%; Number of Terminations: 2; Height: 350um; RoHS Compliant: Yes; Lead Free: 5697LeadFree; ComponentLink1URL: http://www.vishay.com/docs/28773/crcwce3.pdf?src-supplier=Digikey; ComponentLink1Description: http://www.vishay.com/docs/28773/crcwce3.pdf?src-supplier=Digikey; ComponentLink2URL: https://datasheet.octopart.com/CRCW04021M00FKEDC-Vishay-datasheet-100063072.pdf?src-supplier=Future+Electronics; ComponentLink2Description: https://datasheet.octopart.com/CRCW04021M00FKEDC-Vishay-datasheet-100063072.pdf?src-supplier=Future+Electronics; Supplier Part Number 1: 71-CRCW04021M00FKEDC
U1 = MMA3201KEGR2: Accelerometer Dual ±40g 4.75V to 5.25V 47.5mV/g to 52.5mV/g 20-Pin SOIC T/R; Manufacturer: NXP Freescale; Supplier 1: Newark; Manufacturer Part Number: MMA3201KEGR2; RoHS: Yes; Category: Accelerometers; Pricing 1: 1000=10,72 (USD); Mount: Surface Mount; Case/Package: SOIC; Number of Pins: 20; Weight: 0.008826oz; Min Operating Temperature: -40°C; Max Operating Temperature: 125°C; Packaging: Tape and Reel; Series: MMA3201; Package Quantity: 1000; Operating Supply Voltage: 5.25V; RoHS Compliant: Yes; ComponentLink1URL: https://datasheet.ciiva.com/3271/mma3201keg-3271720.pdf?src-supplier=Avnet; ComponentLink1Description: https://datasheet.ciiva.com/3271/mma3201keg-3271720.pdf?src-supplier=Avnet; Supplier Part Number 1: 85AK8921
U2 = MAX3232IPWR: IC DRVR/RCVR MLTCH RS232 16TSSOP; Manufacturer: Texas Instruments; Data Rate: 250Kbps; Number of Receivers: 2; Operating Supply Voltage: 5V; Logic Function: Transceiver,Receiver; Max Supply Voltage: 5.5V; Min Supply Voltage: 3V; Number of Transceivers: 1; Supply Current: 1mA; Simplex/Duplex: Full Duplex; Supplier 1: Mouser; Manufacturer Part Number: MAX3232IPWR; RoHS: Yes; Category: Interface ICs; Stock 1: 72064; Pricing 1: 1=0,85, 10=0,546, 50=0,546, 100=0,447, 1000=0,413, 10000=0,37 (USD); Mount: Surface Mount; Case/Package: TSSOP; Number of Pins: 16; Weight: 0.002183oz; Min Operating Temperature: -40°C; Max Operating Temperature: 85°C; Number of Transmitters: 2; Package Quantity: 1; Packaging: Tape and Reel; Number of Drivers: 2; Series: -; Operating Supply Current: 1mA; Lead Free: Lead Free; RoHS Compliant: Yes; Reach SVHC Compliant: No; ComponentLink1URL: https://datasheet.ciiva.com/1702/max3232-1702050.pdf?src-supplier=Digikey; ComponentLink1Description: https://datasheet.ciiva.com/1702/max3232-1702050.pdf?src-supplier=Digikey; ComponentLink2URL: https://datasheet.ciiva.com/1702/max3232-1702051.pdf?src-supplier=Digikey; ComponentLink2Description: https://datasheet.ciiva.com/1702/max3232-1702051.pdf?src-supplier=Digikey; ComponentLink3URL: https://datasheet.ciiva.com/1702/max3232-1702052.pdf?src-supplier=Digikey; ComponentLink3Description: https://datasheet.ciiva.com/1702/max3232-1702052.pdf?src-supplier=Digikey; ComponentLink4URL: https://datasheet.ciiva.com/8064/1882754-8064747.pdf?src-supplier=Element14; ComponentLink4Description: https://datasheet.ciiva.com/8064/1882754-8064747.pdf?src-supplier=Element14; ComponentLink5URL: https://datasheet.ciiva.com/46384/1882754-46384398.pdf?src-supplier=Element14; ComponentLink5Description: https://datasheet.ciiva.com/46384/1882754-46384398.pdf?src-supplier=Element14; ComponentLink6URL: https://datasheet.ciiva.com/48709/001047902-da-01-en-ic-drv-rx-mulch-max3232ipwr-tssop-16-tid-48709190.pdf?src-supplier=Conrad; ComponentLink6Description: https://datasheet.ciiva.com/48709/001047902-da-01-en-ic-drv-rx-mulch-max3232ipwr-tssop-16-tid-48709190.pdf?src-supplier=Conrad; Supplier Part Number 1: 595-MAX3232IPWR
U3 = PIC18F2523-I/SO: Microchip PIC18F2523-I/SO; 8bit PIC Microcontroller; 40MHz; 32 kB Flash; 28-Pin SOIC; Interface: I2C,SPI,UART,USART; RAM Size: 1.5KB; Max Supply Voltage: 5.5V; Min Supply Voltage: 4.2V; Number of PWM Channels: 2; Max Power Dissipation: 1W; Number of I/Os: 25; Number of Timers/Counters: 4; Number of ADC Channels: 10; Density: 32KB; Number of UART Channels: 1; Data Bus Width: 8b; Number of Bits: 8; Oscillator Type: Internal; Watchdog Timer: Yes; Peripherals: Brown-out Detect/Reset,POR,PWM,WDT,HLVD,I2C; Supplier 1: Arrow Electronics; Manufacturer: Microchip; Manufacturer Part Number: PIC18F2523-I/SO; RoHS: Yes; Category: Microcontrollers; Stock 1: 54; Pricing 1: 54=4,674, 108=4,667 (USD); Mount: Surface Mount; Case/Package: SOIC; Number of Pins: 28; Min Operating Temperature: -40°C; Max Operating Temperature: 85°C; Frequency: 40MHz; Packaging: Rail/Tube; Package Quantity: 27; Number of Programmable I/O: 25; Max Frequency: 40MHz; Number of SPI Channels: 1; Number of I2C Channels: 1; Memory Type: FLASH; Termination: SMD/SMT; Memory Size: 32KB; Core Architecture: PIC; Series: PIC® 18F; Length: 17.9mm; Width: 7.5mm; Height: 2.35mm; Radiation Hardening: No; Reach SVHC Compliant: No; Lead Free: Lead Free; RoHS Compliant: Yes; ComponentLink1URL: https://datasheet.ciiva.com/1493/39755c-1493947.pdf?src-supplier=Digikey; ComponentLink1Description: https://datasheet.ciiva.com/1493/39755c-1493947.pdf?src-supplier=Digikey; ComponentLink2URL: https://datasheet.ciiva.com/16478/39755c-16478411.pdf?src-supplier=Future+Electronics; ComponentLink2Description: https://datasheet.ciiva.com/16478/39755c-16478411.pdf?src-supplier=Future+Electronics; ComponentLink3URL: https://datasheet.ciiva.com/7774/39755c-7774347.pdf?src-supplier=Element14; ComponentLink3Description: https://datasheet.ciiva.com/7774/39755c-7774347.pdf?src-supplier=Element14; Supplier Part Number 1: PIC18F2523-I/SO
U4 = MPXH6115A6U: SENSOR ABS PRESS 16.7PSI MAX; Manufacturer: NXP Semiconductors; Output Type: Analog Voltage,Analog; Pressure Type: Absolute; Operating Pressure: 16.68PSI; Accuracy: 1.5%; Port Style: No Port; Max Pressure: 58.02PSI; Min Supply Voltage: 4.75V; Max Supply Voltage: 5.25V; Operating Supply Voltage: 5V; Supply Current: 6mA; Supplier 1: Arrow Electronics; Manufacturer Part Number: MPXH6115A6U; RoHS: No; Category: Pressure Sensors; Stock 1: 5; Pricing 1: 65=9,711, 130=9,651, 520=8,857, 1040=8,847 (USD); Case/Package: SSOP; Number of Pins: 8; Min Operating Temperature: -40°C; Max Operating Temperature: 125°C; Series: MPXH6115A; Termination: PCB; Reach SVHC Compliant: No; ComponentLink1URL: https://datasheet.ciiva.com/2825/mpxa6115a-2825344.pdf?src-supplier=Digikey; ComponentLink1Description: https://datasheet.ciiva.com/2825/mpxa6115a-2825344.pdf?src-supplier=Digikey; ComponentLink2URL: https://datasheet.ciiva.com/1513/1748876-1513862.pdf?src-supplier=Element14; ComponentLink2Description: https://datasheet.ciiva.com/1513/1748876-1513862.pdf?src-supplier=Element14; Supplier Part Number 1: MPXH6115A6U
U5 = IRF7101TRPBF: IRF7101PBF Dual N-channel MOSFET Transistor; 3.5 A; 20 V; 8-Pin SOIC; Manufacturer: International Rectifier; Continuous Drain Current (ID): 3.5A; Input Capacitance: 320pF; Max Power Dissipation: 2W; Gate to Source Voltage (Vgs): 12V; Drain to Source Voltage (Vdss): 20V; Turn-On Delay Time: 7ns; Turn-Off Delay Time: 24ns; Rds On Max: 100mR; FET Type: 2 N-Channel; Supplier 1: Allied Electronics; Manufacturer Part Number: IRF7101TRPBF; RoHS: Yes; Mount: Surface Mount; Case/Package: SOIC; Number of Pins: 8; Min Operating Temperature: -55°C; Max Operating Temperature: 150°C; Packaging: Cut Tape; Package Quantity: 1; Voltage Rating (DC): 20V; Current Rating: 3.5A; Series: HEXFET®; Drain-source On Resistance-Max: 100mR; Length: 5mm; Width: 4mm; Height: 1.5mm; RoHS Compliant: Yes; Lead Free: Lead Free; ComponentLink1URL: https://datasheet.ciiva.com/6385/irf7101pbf-6385610.pdf?src-supplier=Digikey; ComponentLink1Description: https://datasheet.ciiva.com/6385/irf7101pbf-6385610.pdf?src-supplier=Digikey; ComponentLink2URL: https://datasheet.ciiva.com/6385/irf7101pbf-6385613.pdf?src-supplier=Digikey; ComponentLink2Description: https://datasheet.ciiva.com/6385/irf7101pbf-6385613.pdf?src-supplier=Digikey; ComponentLink3URL: https://datasheet.ciiva.com/6385/irf7101pbf-6385615.pdf?src-supplier=Digikey; ComponentLink3Description: https://datasheet.ciiva.com/6385/irf7101pbf-6385615.pdf?src-supplier=Digikey; ComponentLink4URL: https://datasheet.ciiva.com/16359/irf7101pbf-16359627.pdf?src-supplier=Future+Electronics; ComponentLink4Description: https://datasheet.ciiva.com/16359/irf7101pbf-16359627.pdf?src-supplier=Future+Electronics; Supplier Part Number 1: 70016974
U6 = MC78M05BDTG: MC78M00 Series 0.5 A 5 V Fixed Output SMT LDO Voltage Regulator - DPAK; Manufacturer: ON Semiconductor; Output Voltage: 5V; Number of Outputs: 1; Max Input Voltage: 35V; Max Output Current: 500mA; Dropout Voltage: 2V; Min Input Voltage: 7V; Polarity: Positive; Power Supply Rejection Ratio (PSRR): 80dB; Current Rating: 700mA; Input Bias Current: 3.2mA; Accuracy: 4%; Supplier 1: Future Electronics; Manufacturer Part Number: MC78M05BDTG; RoHS: Yes; Category: Voltage Regulators - Linear; Stock 1: 7370; Pricing 1: 1=0,22, 200=0,215, 750=0,205, 2000=0,198, 7500=0,185 (USD); Mount: Surface Mount; Case/Package: DPAK; Number of Pins: 3; Min Operating Temperature: -40°C; Max Operating Temperature: 125°C; Packaging: Rail/Tube; Package Quantity: 75; Output Current: 500mA; Nominal Output Voltage: 5V; Number of Regulators: 1; Min Output Voltage: 5V; Operating Supply Voltage: 35V; Output Type: Fixed; Series: -; Output Configuration: Positive; Nominal Supply Current: 3.2mA; Number of Channels: 1; Length: 6.73mm; Width: 6.22mm; Height: 2.38mm; Radiation Hardening: No; Reach SVHC Compliant: No; Lead Free: Lead Free; Halogen Free: Halogen Free; RoHS Compliant: Yes; ComponentLink1URL: https://datasheet.ciiva.com/2052/mc78m00-d-2052360.pdf?src-supplier=Digikey; ComponentLink1Description: https://datasheet.ciiva.com/2052/mc78m00-d-2052360.pdf?src-supplier=Digikey; ComponentLink2URL: https://datasheet.ciiva.com/3224/mc78m00-d-3224079.pdf?src-supplier=Avnet; ComponentLink2Description: https://datasheet.ciiva.com/3224/mc78m00-d-3224079.pdf?src-supplier=Avnet; ComponentLink3URL: https://datasheet.ciiva.com/16381/mc78m00-d-16381163.pdf?src-supplier=Future+Electronics; ComponentLink3Description: https://datasheet.ciiva.com/16381/mc78m00-d-16381163.pdf?src-supplier=Future+Electronics; ComponentLink4URL: https://datasheet.ciiva.com/7992/1746757-7992652.pdf?src-supplier=Element14; ComponentLink4Description: https://datasheet.ciiva.com/7992/1746757-7992652.pdf?src-supplier=Element14; ComponentLink5URL: https://datasheet.ciiva.com/4882/mc78m00-d-88441-4882543.pdf?src-supplier=Mouser; ComponentLink5Description: https://datasheet.ciiva.com/4882/mc78m00-d-88441-4882543.pdf?src-supplier=Mouser; ComponentLink6URL: https://datasheet.ciiva.com/18435/70099623-18435694.pdf?src-supplier=Allied+Electronics; ComponentLink6Description: https://datasheet.ciiva.com/18435/70099623-18435694.pdf?src-supplier=Allied+Electronics; Supplier Part Number 1: 8771974
X1 = NX5032GA-10.000000MHZ-LN-CD-1: Crystal 10.0000MHZ 8PF SMD; Manufacturer: NDK; Frequency: 10MHz; Frequency Tolerance: 50ppm; ESR (Equivalent Series Resistance): 120R; Supplier 1: Richardson RFPD; Manufacturer Part Number: NX5032GA-10.000000MHZ-LN-CD-1; RoHS: Yes; Category: Crystals; Mount: Surface Mount; Case/Package: SMD/SMT; Number of Pins: 2; Min Operating Temperature: -10°C; Max Operating Temperature: 70°C; Package Quantity: 1; Load Capacitance: 8pF; Packaging: Cut Tape; Frequency Stability: 50ppm; Series: NX5032GA; Length: 0.197inch; Width: 0.126inch; Height: 0.059inch; ComponentLink1URL: https://datasheet.ciiva.com/856/nx5032ga-856809.pdf?src-supplier=Digikey; ComponentLink1Description: https://datasheet.ciiva.com/856/nx5032ga-856809.pdf?src-supplier=Digikey; ComponentLink2URL: https://datasheet.ciiva.com/856/nx5032ga-856810.pdf?src-supplier=Digikey; ComponentLink2Description: https://datasheet.ciiva.com/856/nx5032ga-856810.pdf?src-supplier=Digikey; ComponentLink3URL: https://datasheet.ciiva.com/856/nx5032ga-856811.pdf?src-supplier=Digikey; ComponentLink3Description: https://datasheet.ciiva.com/856/nx5032ga-856811.pdf?src-supplier=Digikey; Supplier Part Number 1: NX5032GA-10.00E
Y1 = PKLCS1212E4001-R1: AUDIO PIEZO TRANSDUCER 25V SMD / Audio Buzzer Piezo 75dB Surface Mount Solder Pad T/R; Manufacturer: Murata; Self Resonant Frequency: 4kHz; Voltage Rating: 1.5V; Nominal Supply Voltage: 3V; Washable: No; Supplier: Mouser; Supplier Part Number: 81-PKLCS1212E4001; Manufacturer Part Number: PKLCS1212E4001-R1; RoHS: Yes; Category: Speakers; Stock: 27239; Pricing: 1=1,04, 10=0,86, 50=0,758, 100=0,718, 1000=0,534, 10000=0,529 (USD); Mounting Technology: Surface Mount; Min Operating Temperature: -20°C; Max Operating Temperature: 70°C; Max Supply Voltage: 25V; Frequency: 4kHz; Packaging: Tape and Reel; Package Quantity: 1; Termination: Solder; Clock Frequency: 4kHz; Voltage Rating (DC): 25V; Series: PK; Diameter: 12mm; Length: 12mm; Width: 12mm; Height: 3mm; Depth: 12mm; Radiation Hardening: No; Reach SVHC Compliant: No; Lead Free: Lead Free; ComponentLink1URL: https://datasheet.ciiva.com/4625/pklcs-datasheet-202916-4625328.pdf?src-supplier=Mouser; ComponentLink1Description: https://datasheet.ciiva.com/4625/pklcs-datasheet-202916-4625328.pdf?src-supplier=Mouser; ComponentLink2URL: https://datasheet.ciiva.com/16224/s0039e-16224145.pdf?src-supplier=Future+Electronics; ComponentLink2Description: https://datasheet.ciiva.com/16224/s0039e-16224145.pdf?src-supplier=Future+Electronics; ComponentLink3URL: https://datasheet.ciiva.com/11776/0900766b807da0c7-11776763.pdf?src-supplier=Rs; ComponentLink3Description: https://datasheet.ciiva.com/11776/0900766b807da0c7-11776763.pdf?src-supplier=Rs; ComponentLink4URL: https://datasheet.ciiva.com/3333/03787173-3333942.pdf?src-supplier=Distrelec; ComponentLink4Description: https://datasheet.ciiva.com/3333/03787173-3333942.pdf?src-supplier=Distrelec; ComponentLink5URL: https://datasheet.ciiva.com/1323/1626578-1323984.pdf?src-supplier=Element14; ComponentLink5Description: https://datasheet.ciiva.com/1323/1626578-1323984.pdf?src-supplier=Element14; ComponentLink6URL: https://datasheet.ciiva.com/0/s0039e-123.pdf?src-supplier=Digikey; ComponentLink6Description: https://datasheet.ciiva.com/0/s0039e-123.pdf?src-supplier=Digikey; ComponentLink7URL: https://datasheet.ciiva.com/0/s0039e-124.pdf?src-supplier=Digikey; ComponentLink7Description: https://datasheet.ciiva.com/0/s0039e-124.pdf?src-supplier=Digikey; ComponentLink8URL: https://datasheet.ciiva.com/0/s0039e-125.pdf?src-supplier=Digikey; ComponentLink8Description: https://datasheet.ciiva.com/0/s0039e-125.pdf?src-supplier=Digikey; ComponentLink9URL: https://datasheet.ciiva.com/18141/p37e-18141127.pdf?src-supplier=Verical; ComponentLink9Description: https://datasheet.ciiva.com/18141/p37e-18141127.pdf?src-supplier=Verical; ComponentLink10URL: https://datasheet.ciiva.com/8084/p37e-8084265.pdf?src-supplier=Avnet; ComponentLink10Description: https://datasheet.ciiva.com/8084/p37e-8084265.pdf?src-supplier=Avnet; ComponentLink11URL: https://datasheet.ciiva.com/1323/9058-1323985.pdf?src-supplier=Element14; ComponentLink11Description: https://datasheet.ciiva.com/1323/9058-1323985.pdf?src-supplier=Element14